# EAGLE design IOB-Adapter-Output (EAGLE 7.7.0)
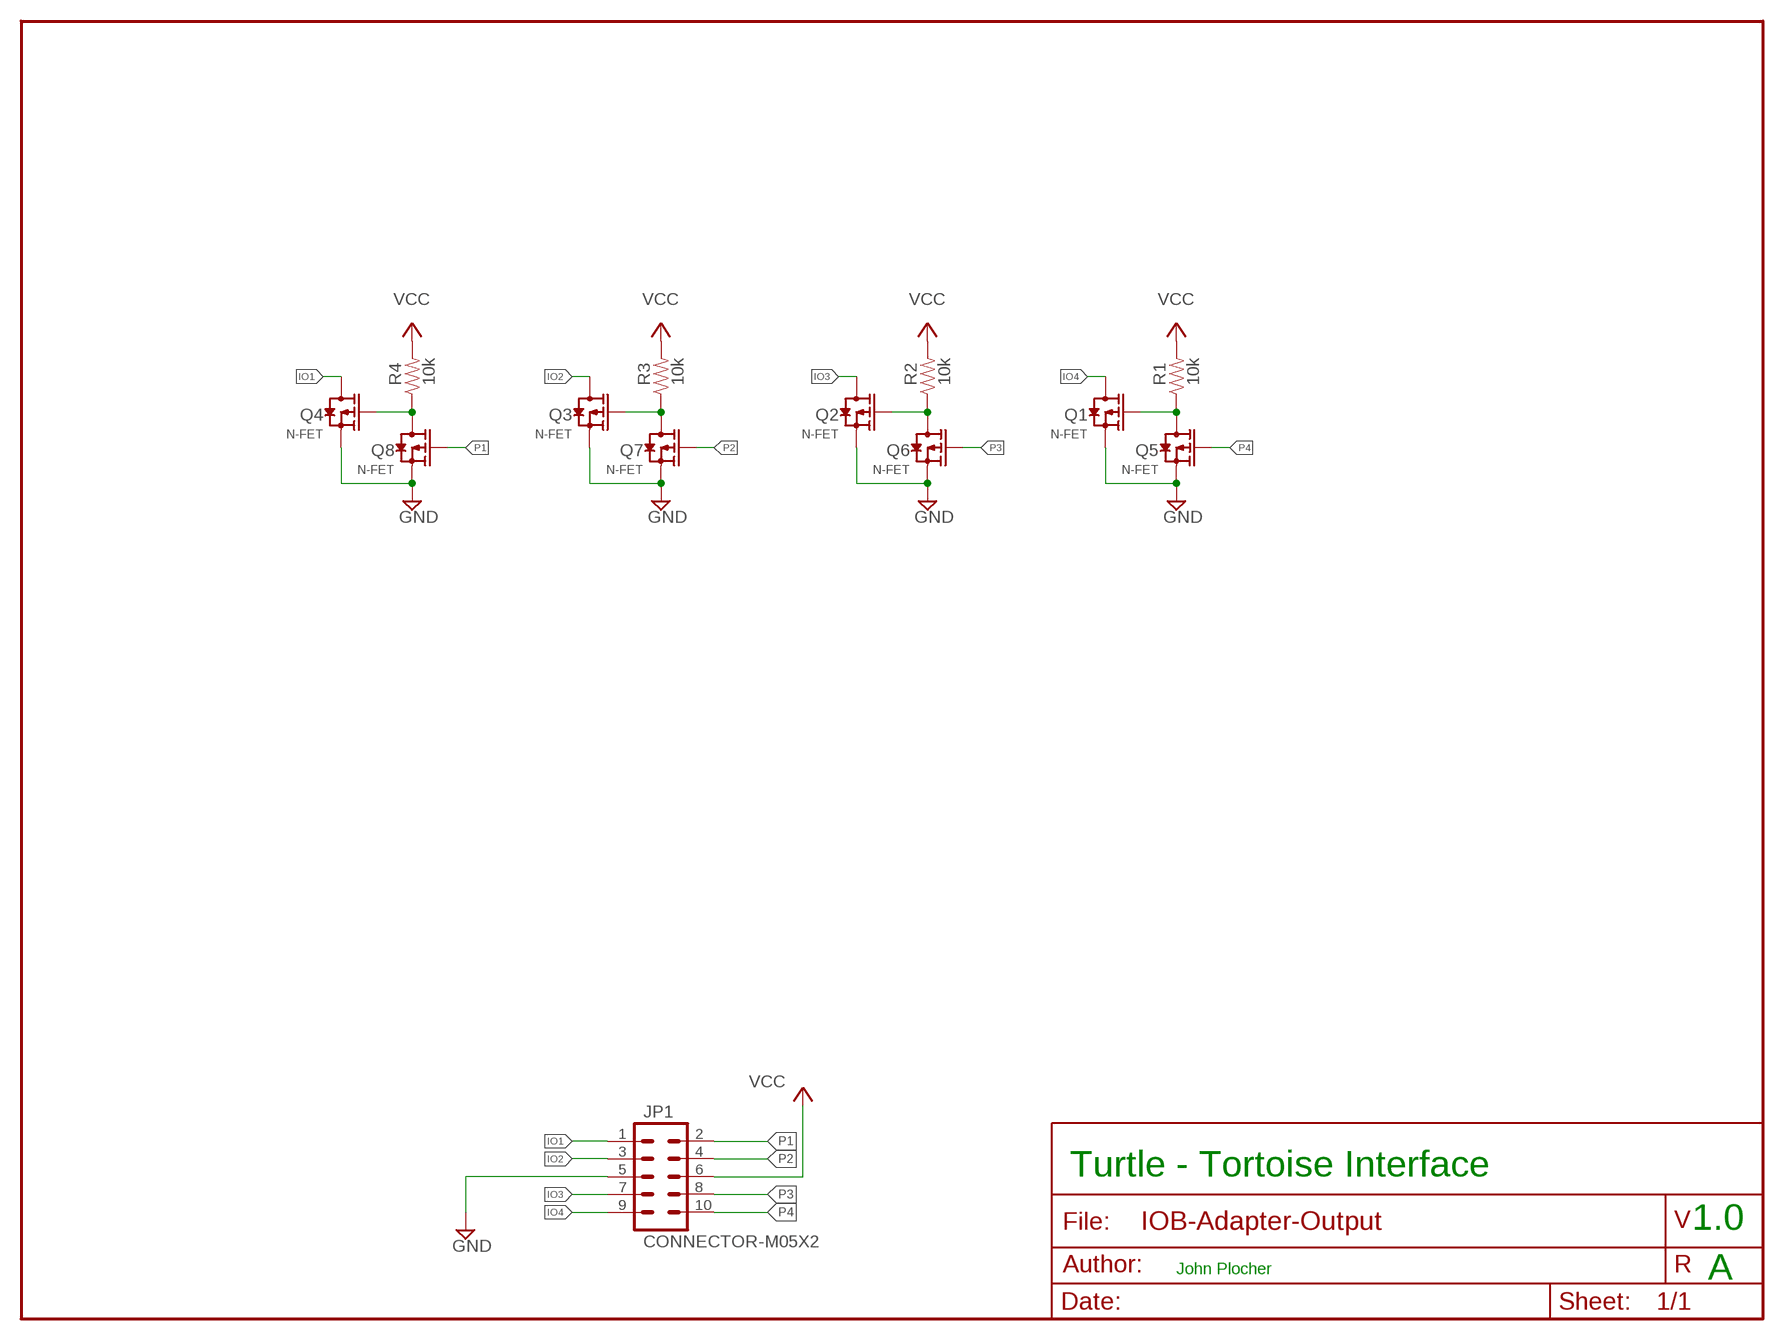
[diagram p0: schematic, sheet 1]

## Parts
JP1  CONNECTOR-M05X2  [IOB-V3-MODULE]
Q1  N-FET  MOSFET-P  [SOT23-3]
Q2  N-FET  MOSFET-P  [SOT23-3]
Q3  N-FET  MOSFET-P  [SOT23-3]
Q4  N-FET  MOSFET-P  [SOT23-3]
Q5  N-FET  MOSFET-P  [SOT23-3]
Q6  N-FET  MOSFET-P  [SOT23-3]
Q7  N-FET  MOSFET-P  [SOT23-3]
Q8  N-FET  MOSFET-P  [SOT23-3]
R1  10k  R0805-RES  [0805-RES]
R2  10k  R0805-RES  [0805-RES]
R3  10k  R0805-RES  [0805-RES]
R4  10k  R0805-RES  [0805-RES]

## Nets
GND [Power]: JP1.5 Q1.2(S) Q2.2(S) Q3.2(S) Q4.2(S) Q5.2(S) Q6.2(S) Q7.2(S) Q8.2(S)
IO1 [signals]: JP1.1 Q4.3(D)
IO2 [signals]: JP1.3 Q3.3(D)
IO3 [signals]: JP1.7 Q2.3(D)
IO4 [signals]: JP1.9 Q1.3(D)
N$1: Q4.1(G) Q8.3(D) R4.1
N$6: Q3.1(G) Q7.3(D) R3.1
N$7: Q2.1(G) Q6.3(D) R2.1
N$8: Q1.1(G) Q5.3(D) R1.1
P1 [signals]: JP1.2 Q8.1(G)
P2 [signals]: JP1.4 Q7.1(G)
P3 [signals]: JP1.8 Q6.1(G)
P4 [signals]: JP1.10 Q5.1(G)
VCC [Power]: JP1.6 R1.2 R2.2 R3.2 R4.2

## Notes on the sheet
- Turtle - Tortoise Interface
- 1.0
- John Plocher
- A

## Library data of the parts
JP1 = SPCoast:CONNECTOR-M05X2: Header 5x2 Standard 10-pin dual row 0.1" header. Commonly used with AVR-ISP. Use with Spark Fun Electronics SKU: PRT-00778
Q1-Q8 = SPCoast:MOSFET-P: CJ2305：SMD MOSFET P-CH 8V-4.1A
R1-R4 = SPCoast:R*: Resistor Basic schematic elements and footprints for 0603, 1206, and PTH 1/10th watt (small) resistors.

## Net classes
0 default: width 0.254 mm, drill 0.5 mm
1 Power: width 0.254 mm, drill 0.6 mm
2 signals: width 0.254 mm, drill 0.5 mm

## Board
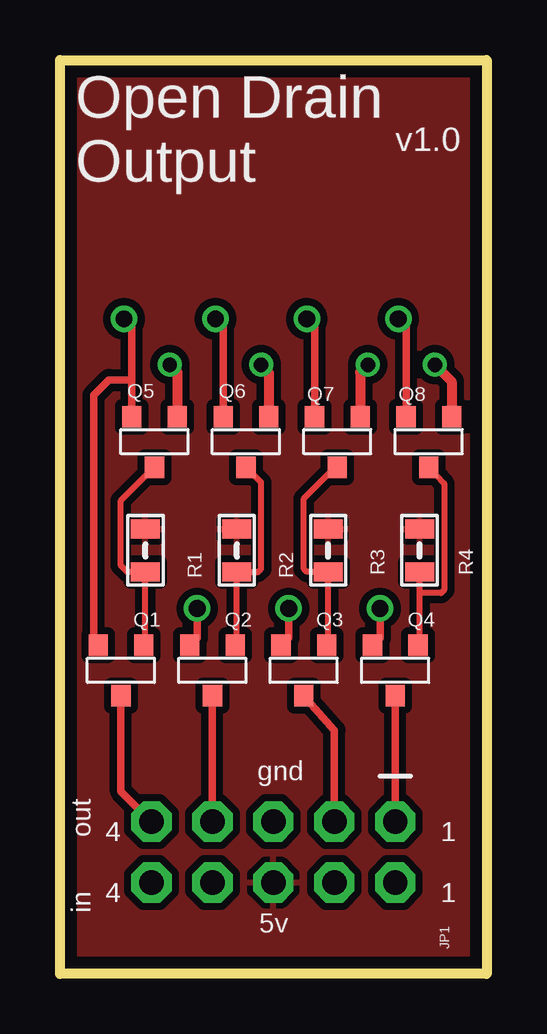
[diagram p1: board, top side]
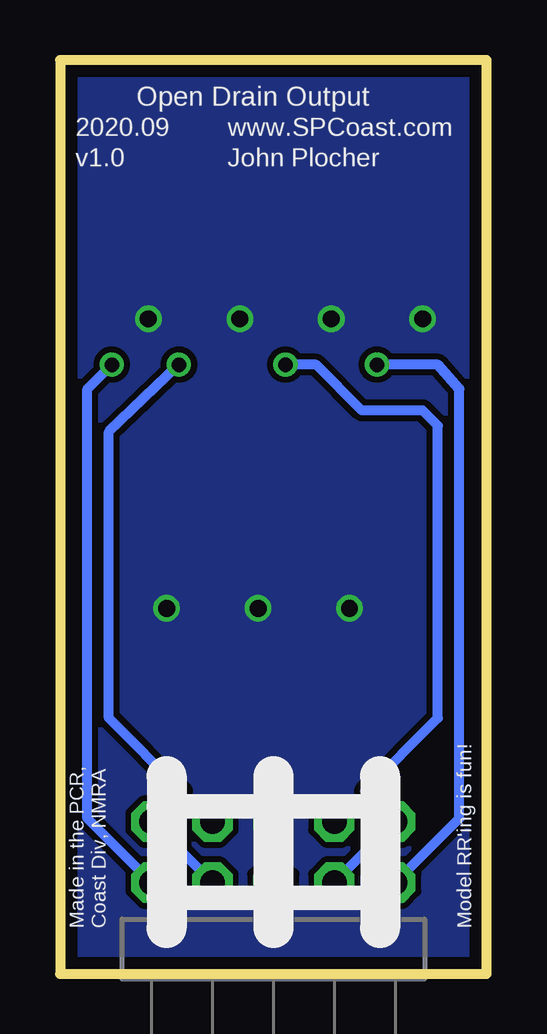
[diagram p2: board, bottom side, seen from below]

Size 17.78 x 38.1 mm. Coordinates in mm from the lower left corner, seen from the top.
Outline: 0,38.1 17.78,38.1 17.78,0 0,0 0,38.1
Copper layers (1*16): Top 0.035mm / dielectric 1.5mm / Bottom 0.035mm
Design rules "default *": minimum track width 10mil, minimum drill 0.6mm, track to track 8mil, track to pad 8mil, pad to pad 8mil, via to via 8mil, smd to smd 8mil, copper to edge 20mil, drill to drill 8mil, minimum pad ring 10mil, minimum via ring 8mil, stop-mask expansion 4mil, vias tented up to drill 0mil, thermal gap 10mil

### Footprints (pad centres in the part's own frame; a part is rotated, then mirrored left to right if it is on the bottom)
IOB-V3-MODULE = drill 1.016 pad 1.676 octagon: 1 -1.27,-5.08; 2 1.27,-5.08; 3 -1.27,-2.54; 4 1.27,-2.54; 5 -1.27,0; 6 1.27,0; 7 -1.27,2.54; 8 1.27,2.54; 9 -1.27,5.08; 10 1.27,5.08
SOT23-3 = smd 0.9 x 0.8: 1 1,-0.95; 2 1,0.95; 3 -1.1,0
0805-RES = smd 0.8 x 1.2: 1 -0.9,0; 2 0.9,0

### Placement (x,y rotation side)
JP1  8.89,5.08 270 bottom
Q1  2.54,12.7 90 top
Q2  6.35,12.7 90 top
Q3  10.16,12.7 90 top
Q4  13.97,12.7 90 top
Q5  3.94,22.23 90 top
Q6  7.75,22.23 90 top
Q7  11.56,22.23 90 top
Q8  15.37,22.23 90 top
R1  3.56,17.65 90 top
R2  7.37,17.65 90 top
R3  11.18,17.65 90 top
R4  14.99,17.65 90 top

### Tracks (layer width: path | path; a pad name or v marks a point on that pad's centre or on a via)
GND  (via drill 0.7)
  Top 0.305: Q5.2 2.99,24.77 | 2.99,24.77 2.99,26.98 v2.67,27.3 | Q6.2 6.8,26.98 v6.48,27.3 | Q7.2 10.61,26.98 v10.29,27.3 | Q8.2 14.42,26.99 v14.1,27.3 | Q1.2 1.4,14.14 1.4,24.13 2.03,24.77 2.99,24.77 | Q2.2 5.71,14.02 v5.71,15.24 | Q3.2 9.53,14.02 v9.53,15.24 | Q4.2 13.34,14.02 v13.34,15.24
  Top 0.406: Q3.2 9.21,13.65 | Q2.2 5.4,13.65 | Q1.2 1.59,13.65
  pour Bottom (isolate 0.254, no thermals): 0.38,0.38 0.38,37.72 17.4,37.72 17.4,0.38
IO1
  Top 0.305: JP1.1 Q4.3
IO2
  Top 0.305: JP1.3 11.43,10.16 Q3.3
IO3
  Top 0.305: JP1.7 Q2.3
IO4
  Top 0.305: JP1.9 2.54,7.62 Q1.3
N$1
  Top 0.254: Q4.1 14.99,13.77 14.99,15.88 | 14.99,15.88 R4.1 | Q8.3 16,20.45 16,16 15.88,15.88 14.99,15.88
N$6
  Top 0.254: Q3.1 11.18,13.77 R3.1 11.29,16.76 10.29,16.76 10.16,16.89 10.16,19.81 11.47,21.12 Q7.3
N$7
  Top 0.254: Q2.1 7.37,13.77 R2.1 8.24,16.75 8.38,16.89 8.38,20.49 Q6.3
N$8
  Top 0.254: Q1.1 3.56,13.77 R1.1 2.81,16.75 2.54,17.02 2.54,19.73 Q5.3
P1  (via drill 0.6)
  Top 0.406: v15.62,25.4 16.32,24.7 Q8.1
  Bottom 0.406: JP1.2 16.64,6.48 16.64,24.38 v15.62,25.4
P2  (via drill 0.6)
  Top 0.406: v12.83,25.4 12.51,25.08 Q7.1
  Bottom 0.305: 12.7,5.08 12.7,7.62
  Bottom 0.406: JP1.4 12.7,5.08 | 12.7,7.62 15.75,10.67 15.75,22.61 v12.83,25.4
P3  (via drill 0.6)
  Top 0.406: v8.38,25.4 8.7,25.09 Q6.1
  Bottom 0.305: 5.08,5.08 5.08,7.62
  Bottom 0.406: JP1.8 5.08,5.08 | 5.08,7.62 2.03,10.67 2.03,22.86 2.67,23.5 5.21,23.5 7.11,25.4 v8.38,25.4
P4  (via drill 0.6)
  Top 0.406: v4.57,25.4 4.89,25.09 Q5.1
  Bottom 0.406: JP1.10 1.14,6.48 1.14,24.38 2.03,25.4 v4.57,25.4
VCC
  pour Top (isolate 0.305): 0.38,0.38 0.38,37.72 17.4,37.72 17.4,0.38

### Text on the board
tPlace: v1.0 | Open Drain / Output
bPlace: Open Drain Output | www.SPCoast.com | 2020.09 | John Plocher | v1.0 | Model RR'ing is fun! | Made in the PCR, / Coast Div, NMRA
Document: Black
_tNames: Q5 | Q6 | Q7 | Q8 | R1 | R2 | R3 | R4 | Q1 | Q2 | Q3 | Q4 | JP1